# EAGLE design date-led-r1 (EAGLE 6.5.0)
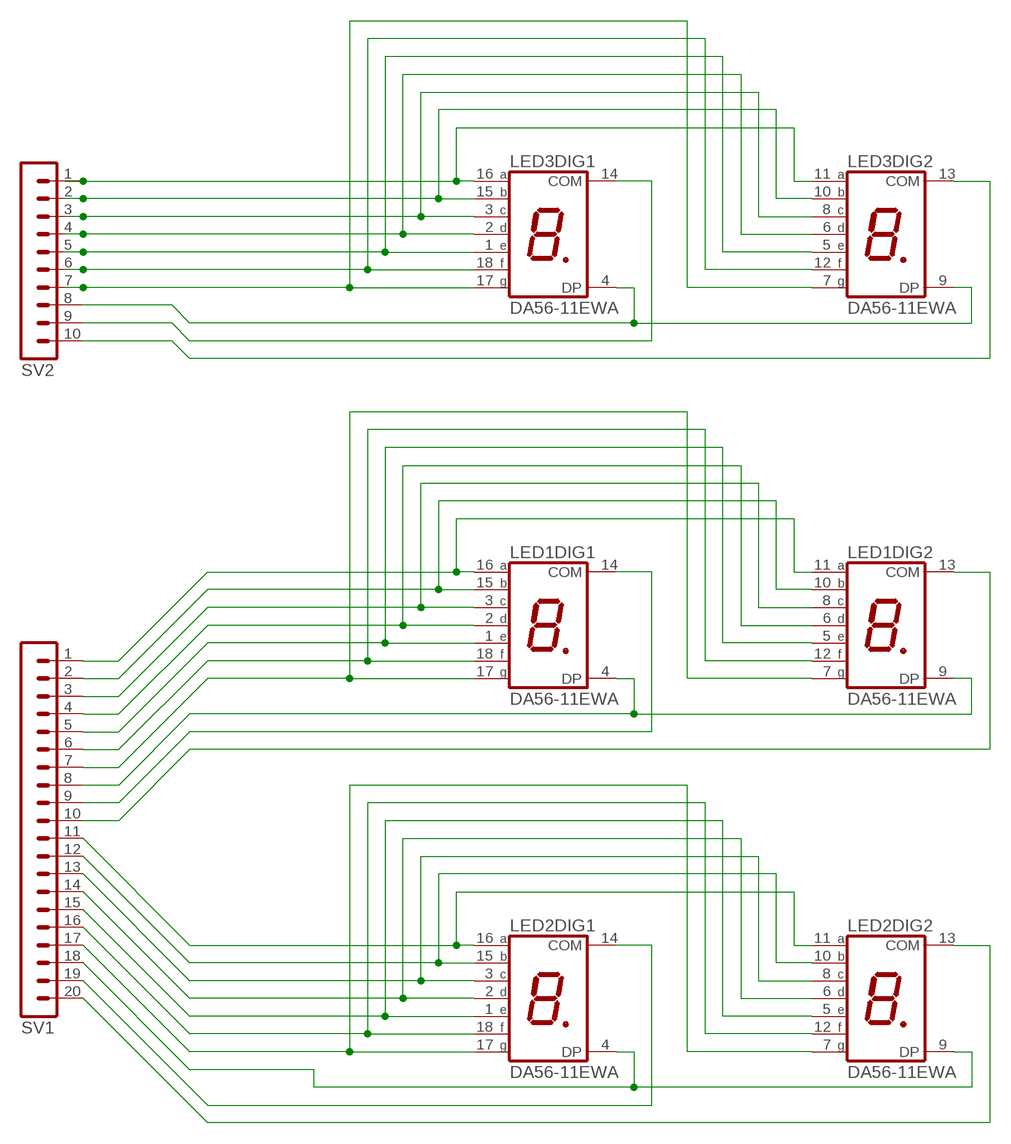
[diagram p0: schematic, sheet 1]

## Parts
LED1  DA56-11EWA  [DA56]
LED2  DA56-11EWA  [DA56]
LED3  DA56-11EWA  [DA56]
SV1  MA20-1W  [MA20-1W]
SV2  MA10-1W  [MA10-1W]

## Nets
N$1: LED1.11(DIG2:A) LED1.16(DIG1:A) SV1.1
N$2: LED1.10(DIG2:B) LED1.15(DIG1:B) SV1.2
N$3: LED1.3(DIG1:C) LED1.8(DIG2:C) SV1.3
N$4: LED1.2(DIG1:D) LED1.6(DIG2:D) SV1.4
N$5: LED1.1(DIG1:E) LED1.5(DIG2:E) SV1.5
N$6: LED1.12(DIG2:F) LED1.18(DIG1:F) SV1.6
N$7: LED1.7(DIG2:G) LED1.17(DIG1:G) SV1.7
N$8: LED1.4(DIG1:DP) LED1.9(DIG2:DP) SV1.8
N$9: LED2.11(DIG2:A) LED2.16(DIG1:A) SV1.11
N$10: LED2.10(DIG2:B) LED2.15(DIG1:B) SV1.12
N$11: LED2.3(DIG1:C) LED2.8(DIG2:C) SV1.13
N$12: LED2.2(DIG1:D) LED2.6(DIG2:D) SV1.14
N$13: LED2.1(DIG1:E) LED2.5(DIG2:E) SV1.15
N$14: LED2.12(DIG2:F) LED2.18(DIG1:F) SV1.16
N$15: LED2.7(DIG2:G) LED2.17(DIG1:G) SV1.17
N$16: LED2.4(DIG1:DP) LED2.9(DIG2:DP) SV1.18
N$17: LED1.13(DIG2:COM) SV1.10
N$19: LED3.11(DIG2:A) LED3.16(DIG1:A) SV2.1
N$20: LED1.14(DIG1:COM) SV1.9
N$21: LED3.10(DIG2:B) LED3.15(DIG1:B) SV2.2
N$22: LED3.3(DIG1:C) LED3.8(DIG2:C) SV2.3
N$23: LED3.2(DIG1:D) LED3.6(DIG2:D) SV2.4
N$24: LED3.1(DIG1:E) LED3.5(DIG2:E) SV2.5
N$25: LED3.12(DIG2:F) LED3.18(DIG1:F) SV2.6
N$26: LED2.14(DIG1:COM) SV1.19
N$27: LED2.13(DIG2:COM) SV1.20
N$28: LED3.7(DIG2:G) LED3.17(DIG1:G) SV2.7
N$29: LED3.4(DIG1:DP) LED3.9(DIG2:DP) SV2.8
N$30: LED3.14(DIG1:COM) SV2.9
N$31: LED3.13(DIG2:COM) SV2.10

## Library data of the parts
LED1-LED3 = display-kingbright:DA56-11: 14.22mm (0.56INCH) DUAL DIGIT NUMERIC DISPLAYS Source: www.kingbright.com .. DA56-11SRWA.pdf; OC_FARNELL: unknown; OC_NEWARK: unknown
SV1 = con-lstb:MA20-1W: PIN HEADER; OC_FARNELL: unknown; OC_NEWARK: unknown
SV2 = con-lstb:MA10-1W: PIN HEADER; OC_FARNELL: unknown; OC_NEWARK: unknown

## Board
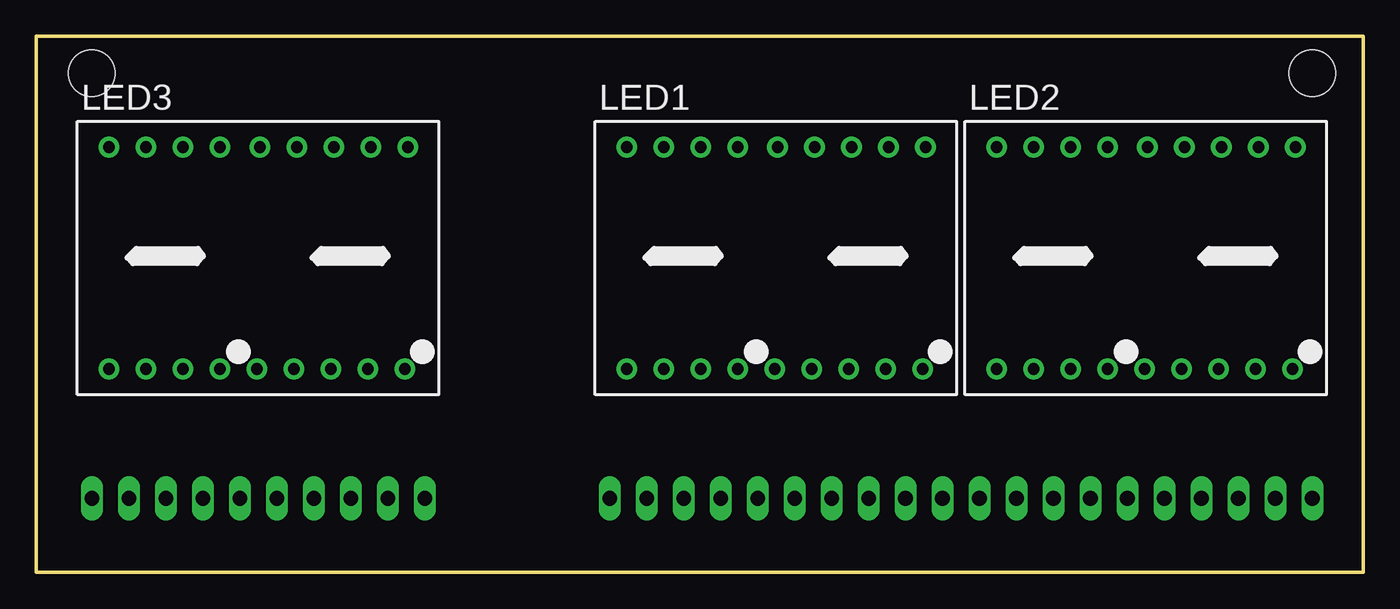
[diagram p1: board, top side]
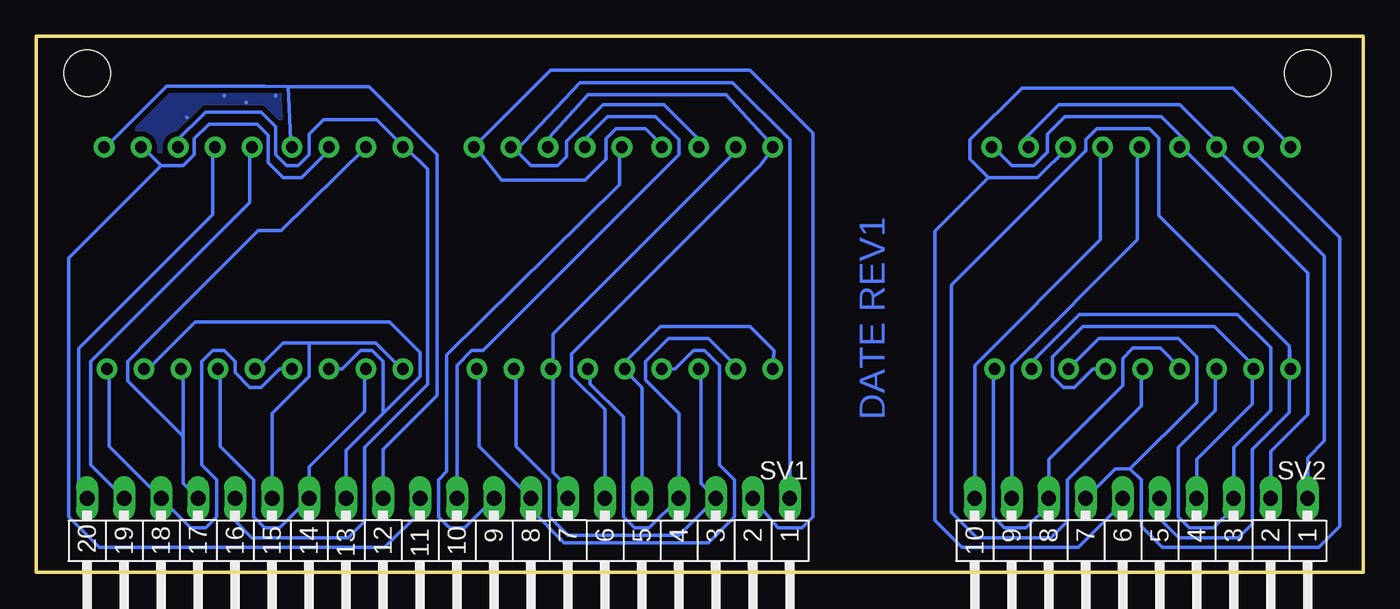
[diagram p2: board, bottom side, seen from below]

Size 91.11 x 36.82 mm. Coordinates in mm from the lower left corner, seen from the top.
Outline: 0,0 91.11,0 91.11,36.82 0,36.82 0,0
Copper layers (1*16): Top 0.035mm / dielectric 1.5mm / Bottom 0.035mm
Design rules "default *": minimum track width 9mil, minimum drill 24mil, track to track 14mil, track to pad 14mil, pad to pad 14mil, via to via 14mil, smd to smd 10mil, copper to edge 40mil, drill to drill 8mil, minimum pad ring 10mil, minimum via ring 8mil, stop-mask expansion 4mil, vias tented up to drill 0mil, thermal gap 10mil
Holes 3.2 mm at 3.81,34.29 87.63,34.29

### Footprints (pad centres in the part's own frame; a part is rotated, then mirrored left to right if it is on the bottom)
DA56 = drill 0.8 pad 1.422: 1 -10.26,-7.62; 2 -7.72,-7.62; 3 -5.18,-7.62; 4 -2.64,-7.62; 5 -0.1,-7.62; 6 2.44,-7.62; 7 4.98,-7.62; 8 7.52,-7.62; 9 10.06,-7.62; 10 10.26,7.62; 11 7.72,7.62; 12 5.18,7.62; 13 2.64,7.62; 14 0.1,7.62; 15 -2.64,7.62; 16 -5.18,7.62; 17 -7.72,7.62; 18 -10.26,7.62
MA20-1W = drill 1.016 long: 1 -24.13,0; 2 -21.59,0; 3 -19.05,0; 4 -16.51,0; 5 -13.97,0; 6 -11.43,0; 7 -8.89,0; 8 -6.35,0; 9 -3.81,0; 10 -1.27,0; 11 1.27,0; 12 3.81,0; 13 6.35,0; 14 8.89,0; 15 11.43,0; 16 13.97,0; 17 16.51,0; 18 19.05,0; 19 21.59,0; 20 24.13,0
MA10-1W = drill 1.016 long: 1 -11.43,0; 2 -8.89,0; 3 -6.35,0; 4 -3.81,0; 5 -1.27,0; 6 1.27,0; 7 3.81,0; 8 6.35,0; 9 8.89,0; 10 11.43,0

### Placement (x,y rotation side)
LED1  50.8,21.59 0 top
LED2  76.2,21.59 0 top
LED3  15.24,21.59 0 top
SV1  63.5,5.08 180 bottom
SV2  15.24,5.08 180 bottom

### Tracks (layer width: path | path; a pad name or v marks a point on that pad's centre or on a via)
N$1
  Bottom 0.229: 58.17,28.96 58.42,29.21 LED1.11 58.17,28.96 | 58.17,28.96 57.15,27.94 55.31,27.94 54.7,28.54 54.7,29.62 52.2,32.13 48.01,32.13 45.4,29.53 LED1.16 | SV1.1 39.37,29.72 43.31,33.66 53.78,33.66 58.17,28.96
N$2
  Bottom 0.229: LED1.15 48.01,29.21 49.28,30.48 51.31,30.48 52.01,29.78 52.01,28.38 53.44,26.96 59.18,26.96 60.96,29.21 | 60.96,29.21 61.02,29.27 | 60.96,29.21 LED1.10 61.02,29.27 | SV1.2 40.2,3.05 38.54,3.05 37.78,3.81 37.78,30.16 42.1,34.48 55.82,34.48 61.02,29.27
N$3
  Bottom 0.229: LED1.3 45.47,13.97 45.47,6.1 SV1.3 46.99,2.54 54.61,2.54 55.88,3.81 55.88,6.35 58.17,8.64 58.17,13.97 LED1.8
N$4
  Bottom 0.229: LED1.2 43.18,14.29 44.96,16.07 47.69,16.07 49.28,14.48 49.28,13.21 46.99,10.92 SV1.4 49.02,3.05 50.04,3.05 50.8,3.81 50.8,10.67 53.09,12.95 53.09,13.97 LED1.6
N$5
  Bottom 0.229: LED1.1 40.45,15.24 42.1,16.89 48.26,16.89 50.55,14.61 LED1.5 50.8,13.97 49.53,12.7 SV1.5
N$6
  Bottom 0.229: 40.45,29.21 LED1.18 | 40.45,29.21 43.75,32.83 53.21,32.83 56.2,29.53 LED1.12 | SV1.6 52.07,11.18 54.36,13.46 54.36,14.99 41.4,27.94 40.45,29.21
N$7
  Bottom 0.229: 55.63,13.97 55.63,6.86 54.61,5.84 SV1.7 | 55.63,13.97 55.63,16.38 43.18,28.83 43.18,29.21 LED1.17 | 55.63,13.97 LED1.7
N$8
  Bottom 0.229: LED1.4 47.24,13.97 45.97,15.24 45.21,15.24 44.2,14.22 44.2,7.37 43.18,6.35 43.18,3.81 44.96,2.03 54.86,2.03 57.15,4.32 SV1.8 60.71,8.64 60.71,13.97 LED1.9
N$9
  Bottom 0.229: 82.55,27.94 81.03,27.94 80.26,28.7 80.26,29.78 79.25,30.8 75.95,30.8 75.18,30.04 75.18,28.13 74.17,27.11 72.9,27.11 71.12,28.89 LED2.16 | 82.55,27.94 83.82,29.21 LED2.11 | SV1.11 64.77,4.13 67.18,1.71 86.81,1.71 88.9,3.81 88.9,21.59 82.55,27.94
N$10
  Bottom 0.229: 73.82,33.37 75.44,33.4 82.17,33.4 86.36,29.21 LED2.10 | 73.82,33.37 73.66,29.72 73.66,29.21 LED2.15 | SV1.12 67.31,8.45 63.59,12.16 63.59,28.7 68.26,33.37 73.82,33.37
N$11
  Bottom 0.229: LED2.3 70.1,13.97 68.83,15.24 68.07,15.24 67.31,14.48 67.31,10.92 | 67.31,10.92 69.85,8.38 SV1.13 | LED2.8 83.44,13.97 80.2,17.21 66.86,17.21 64.77,15.11 64.77,13.46 67.31,10.92
N$12
  Bottom 0.229: LED2.2 68.58,13.97 68.58,11.05 72.39,7.24 SV1.14 74.42,3.05 75.44,3.05 76.2,3.81 76.2,6.35 78.49,8.64 78.49,13.97 LED2.6
N$13
  Bottom 0.229: 72.39,15.75 74.17,15.75 75.95,13.97 LED2.5 | 72.39,15.75 67.82,15.75 66.04,13.97 LED2.1 | SV1.15 74.93,10.92 72.39,13.46 72.39,15.75
N$14
  Bottom 0.229: 65.85,29.21 67.75,31.11 71.37,31.11 72.39,30.1 72.39,28.7 73.15,27.94 73.91,27.94 74.68,28.7 74.68,30.61 75.69,31.62 79.5,31.62 81.6,29.53 LED2.12 | SV1.16 77.47,3.52 76.33,2.38 69.69,2.38 68.58,3.49 68.58,8.57 64.26,12.89 64.26,27.69 65.79,29.21 65.85,29.21 | 65.85,29.21 LED2.18
N$15
  Bottom 0.229: 81.03,9.34 81.03,6.1 SV1.17 | 81.03,9.34 81.03,13.97 LED2.7 | LED2.17 74.3,23.5 75.88,23.5 83.95,15.4 84.07,15.24 84.84,14.48 84.84,13.14 81.03,9.34
N$16
  Bottom 0.229: LED2.4 74.42,13.97 75.69,12.7 76.45,12.7 77.47,13.72 77.47,14.48 78.23,15.24 78.99,15.24 79.76,14.48 79.76,7.37 78.74,6.35 78.74,3.81 79.5,3.05 80.52,3.05 SV1.18 86.11,8.64 86.11,13.97 LED2.9
N$17
  Bottom 0.229: SV1.10 62.23,14.22 61.21,15.24 60.45,15.24 46.99,28.7 46.99,29.72 48.58,31.3 51.88,31.3 53.66,29.53 LED1.13
N$18
  Bottom 0.229: 78.23,32.77 78.23,32.73 | 80.77,31.24 80.8,31.27 | 74.68,32.77 74.68,32.71 | 76.71,32.26 76.71,32.3
  pour Bottom: 0,36.51 90.81,36.51 90.81,0 0,0
N$19
  Bottom 0.229: 10.16,29.21 10.29,29.84 12.57,32.13 20.89,32.13 23.18,29.84 LED3.11 | SV2.1 3.81,7.87 2.67,9.02 2.67,21.72 10.16,29.21 | 10.16,29.21 LED3.16
N$20
  Bottom 0.229: SV1.9 61.72,3.05 62.74,3.05 63.5,3.81 63.5,6.35 62.93,6.92 62.93,14.92 51.05,26.64 51.05,29.21 LED1.14
N$21
  Bottom 0.229: LED3.10 25.4,29.21 24.13,27.94 22.61,27.94 21.68,28.86 21.68,30.1 20.48,31.3 13.84,31.3 12.38,29.84 LED3.15 12.45,29.21 3.81,20.57 3.81,10.86 6.35,8.32 SV2.2
N$22
  Bottom 0.229: LED3.3 10.16,13.97 10.16,11.11 12.7,8.57 12.7,3.81 11.94,3.05 10.29,3.05 8.89,4.45 SV2.3 8.89,8.57 6.35,11.11 6.35,15.43 8.64,17.72 19.49,17.72 22.61,14.61 LED3.8
N$23
  Bottom 0.229: 7.62,14.29 7.62,11.56 11.43,7.75 SV2.4 | LED3.6 18.54,13.97 19.81,12.7 20.57,12.7 21.34,13.46 21.34,14.8 19.24,16.89 10.22,16.89 7.62,14.29 | 7.62,14.29 LED3.2
N$24
  Bottom 0.229: 5.08,15.56 5.08,10.99 7.62,8.45 7.62,3.33 8.57,2.38 12.67,2.38 13.97,3.68 SV2.5 | 5.08,15.56 14.03,24.51 14.03,29.84 14.67,30.48 18.29,30.48 19.05,29.72 19.05,28.96 28.26,19.75 28.26,4.13 26.51,2.38 21.43,2.38 20.32,3.49 20.32,6.35 15.24,11.43 15.24,13.97 LED3.5 | 5.08,15.56 LED3.1
N$25
  Bottom 0.229: LED3.18 5.52,29.84 8.95,33.27 23.43,33.27 26.99,29.72 26.99,28.38 25.72,27.11 | 25.72,27.11 22.35,27.11 20.26,29.21 LED3.12 | SV2.6 16.51,4.76 19.56,1.71 27.56,1.71 29.4,3.56 29.4,23.43 25.72,27.11
N$26
  Bottom 0.229: SV1.19 87.38,7.37 87.38,14.48 76.45,25.4 76.45,29.21 LED2.14
N$27
  Bottom 0.229: SV1.20 88.2,5.33 88.2,15.37 78.99,24.57 78.99,29.21 LED2.13
N$28
  Bottom 0.229: 16,7.11 15.24,6.35 15.24,3.17 13.78,1.71 3.05,1.71 1.59,3.17 1.59,22.99 7.37,28.77 7.37,29.21 LED3.17 | 16,7.11 17.02,7.11 SV2.7 | LED3.7 19.94,14.29 18.16,16.07 12.7,16.07 11.43,14.8 11.43,11.68 16,7.11
N$29
  Bottom 0.229: LED3.4 12.51,13.97 13.94,15.4 15.81,15.4 16.51,14.7 16.51,12.83 21.59,7.75 SV2.8 21.59,4.6 23.15,3.05 24.64,3.05 25.4,3.81 25.4,13.97 LED3.9
N$30
  Bottom 0.229: SV2.9 24.13,14.22 15.49,22.86 15.49,29.21 LED3.14
N$31
  Bottom 0.229: SV2.10 26.67,14.22 18.03,22.86 18.03,29.21 LED3.13

### Text on the board
Bottom: DATE REV1